# Altium schematic sheet Power_supply.SchDoc
size 420 x 297 mm; Address1: Address1; Address2: Address2; Address3: Address3; Address4: Address4; DocumentNumber: *Э3; SheetNumber: 4; SheetTotal: 10; DocumentType: Схема электрическая *
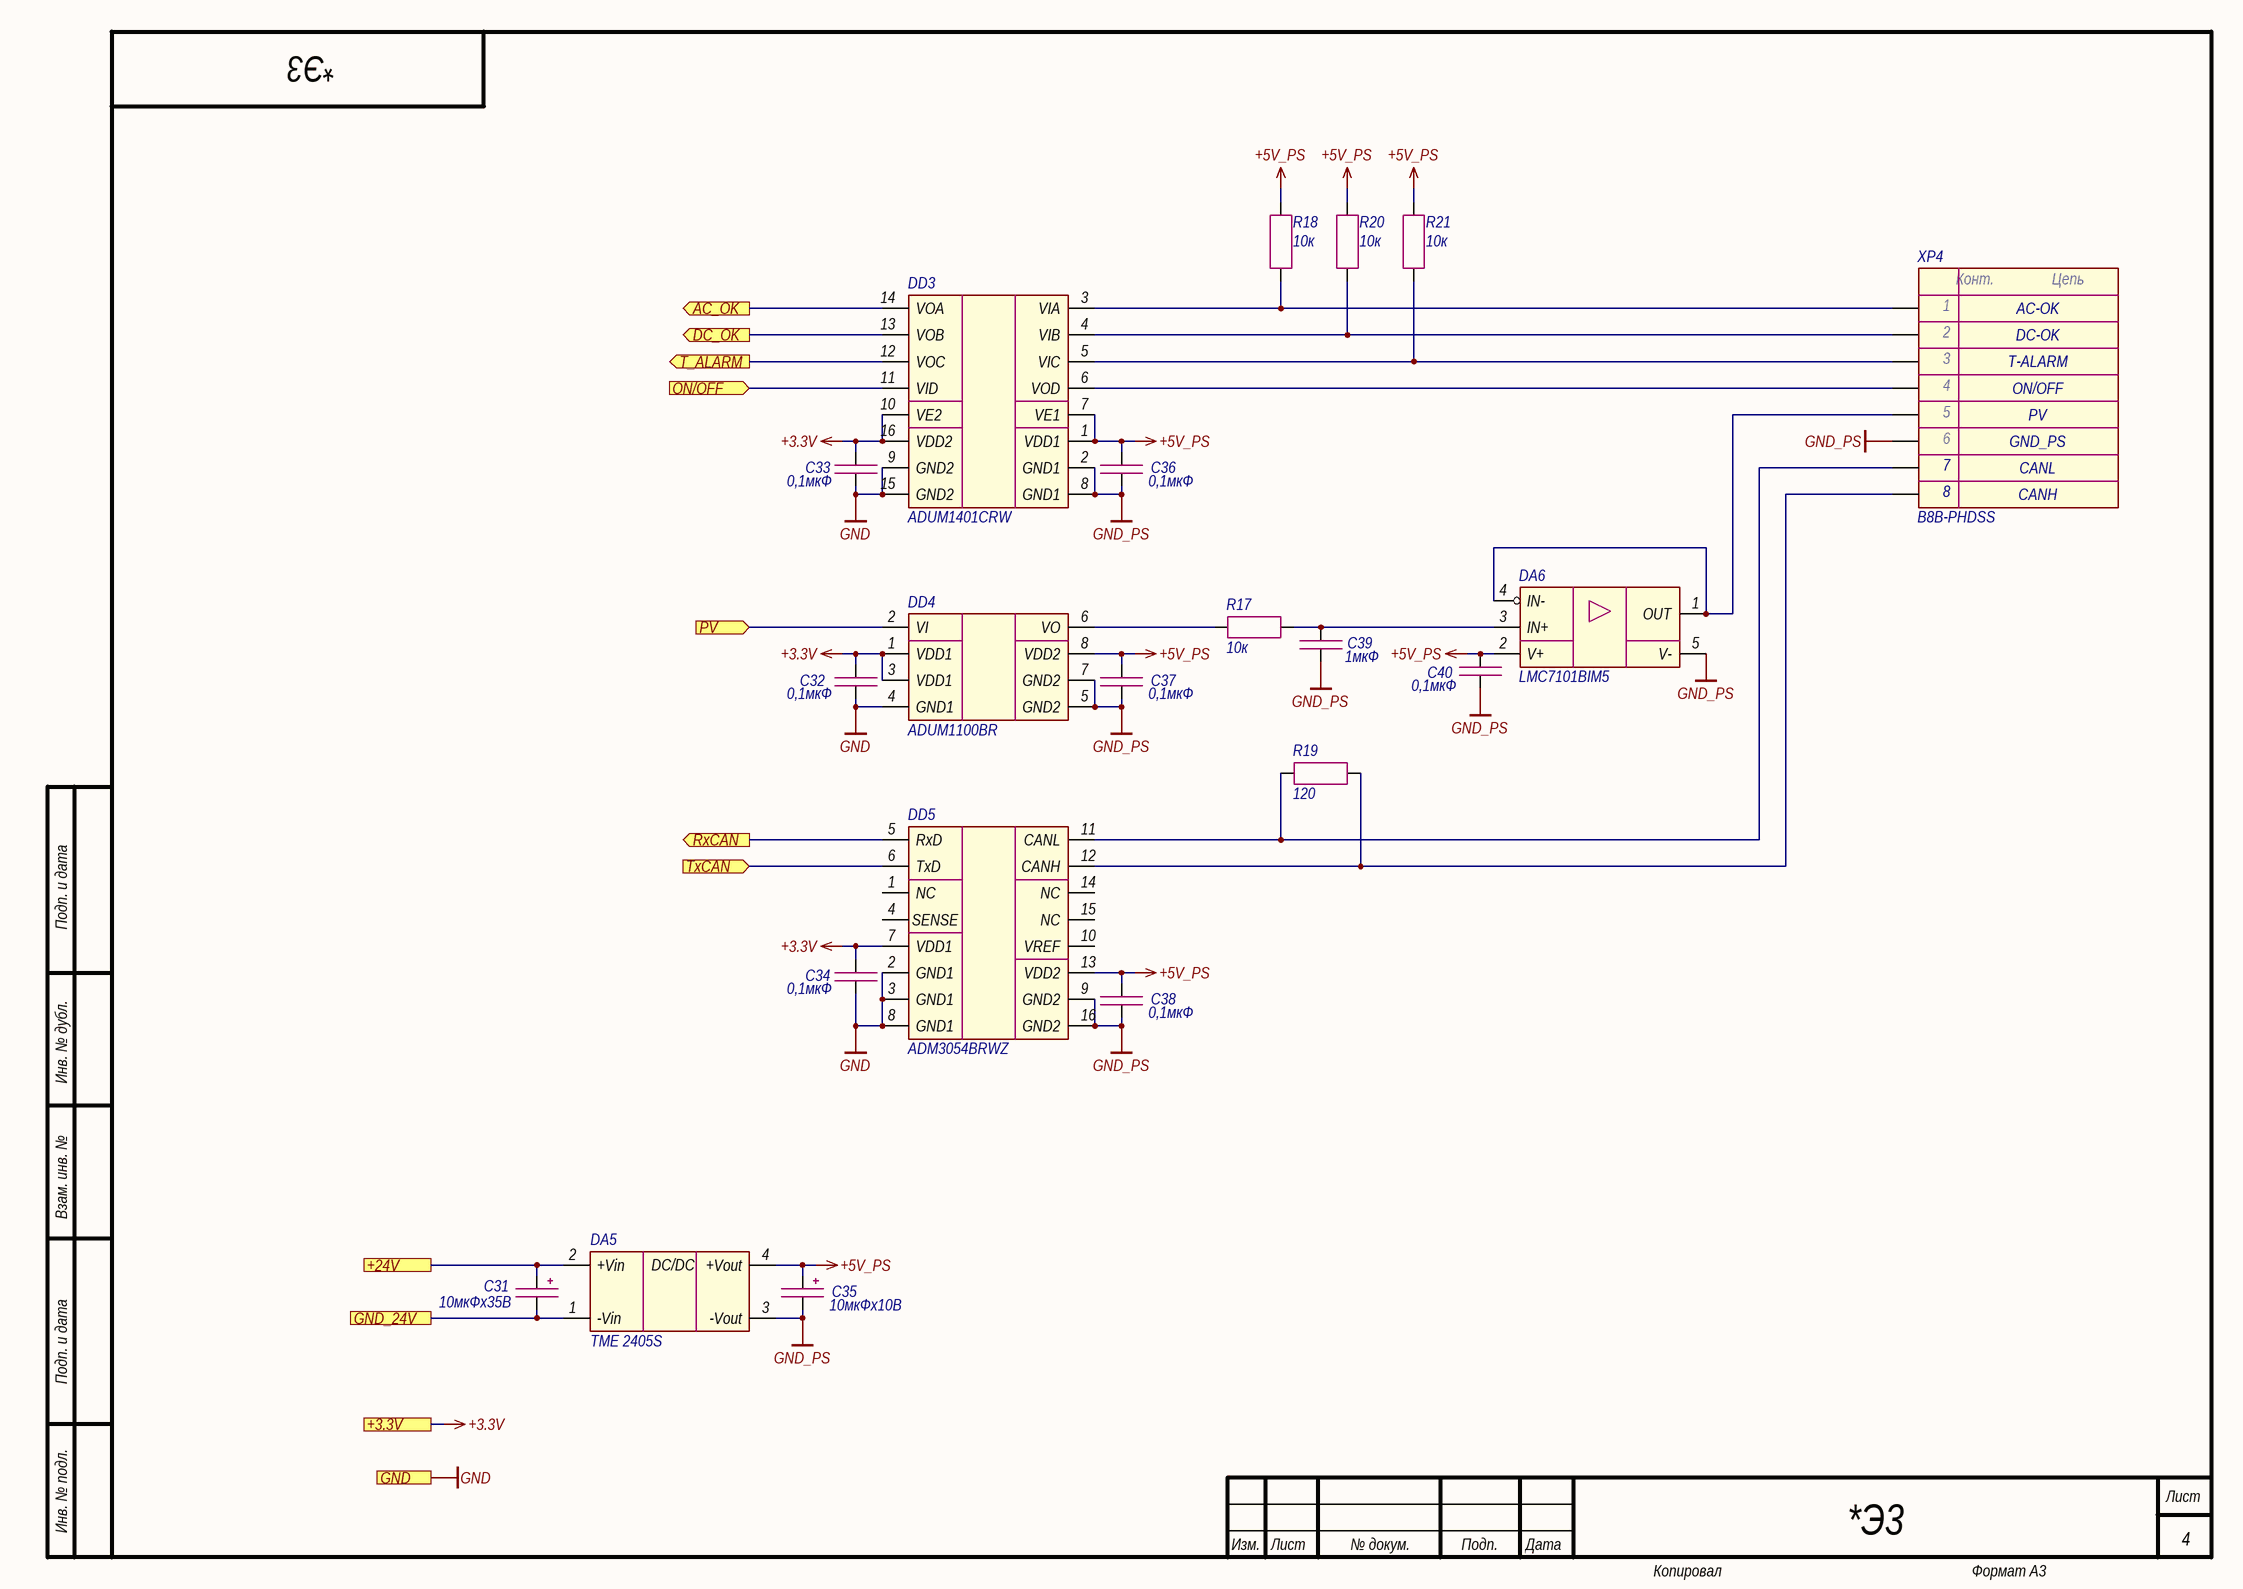
[diagram p0: Power_supply.SchDoc]

## Parts
C31  10мкФх35B  [CAP_C]
C32  0,1мкФ  [CAP_0603]
C33  0,1мкФ  [CAP_0603]
C34  0,1мкФ  [CAP_0603]
C35  10мкФх10B  [CAP_A]
C36  0,1мкФ  [CAP_0603]
C37  0,1мкФ  [CAP_0603]
C38  0,1мкФ  [CAP_0603]
C39  1мкФ  [CAP_0603]
C40  0,1мкФ  [CAP_0603]
DA5  TME 2405S  [TME (SIP-4)]
DA6  LMC7101BIM5  [SOT-23-5]
DD3  ADUM1401CRW  [SOIC-16W]
DD4  ADUM1100BR  [SOIC-8]
DD5  ADM3054BRWZ  [SOIC-16W]
R17  10к  [RES_0603]
R18  10к  [RES_0603]
R19  120  [RES_0805]
R20  10к  [RES_0603]
R21  10к  [RES_0603]
XP4  B8B-PHDSS  [B8B-PHDSS]

## Ports
+3.3V (see Main[1B], Ethernet[3D], Fiber_interlock[2C], Hardwiring[3D], LD_driver[1D]), +24V (see Main[1B], Hardwiring[3C], Indication[1C], LD_driver[1C]), AC_OK (out, see Main[2B]), DC_OK (out, see Main[2B]), GND (see Main[1B], Ethernet[3D], Fiber_interlock[2C], Guide_laser[1C], Hardwiring[3D], Indication[1C], LD_driver[1D]), GND_24V (see Main[1B], Hardwiring[3C], Indication[1C], LD_driver[1D]), ON/OFF (in, see Main[1B]), PV (in, see Main[1B]), RxCAN (out, see Main[2B]), T_ALARM (out, see Main[2B]), TxCAN (in, see Main[2B])

## Nets
+3.3V: C32.1 C33.1 C34.1 DD3.10(VE2) DD3.16(VDD2) DD4.1(VDD1) DD4.3(VDD1) DD5.7(VDD1) ; port +3.3V
+5V_PS: C35.1 C36.1 C37.1 C38.1 C40.1 DA5.4(+Vout) DA6.2(V+) DD3.1(VDD1) DD3.7(VE1) DD4.8(VDD2) DD5.13(VDD2) R18.1 R20.1 R21.1
GND: C32.2 C33.2 C34.2 DD3.9(GND2) DD3.15(GND2) DD4.4(GND1) DD5.2(GND1) DD5.3(GND1) DD5.8(GND1) ; port GND
GND_PS: C35.2 C36.2 C37.2 C38.2 C39.2 C40.2 DA5.3(-Vout) DA6.5(V-) DD3.2(GND1) DD3.8(GND1) DD4.5(GND2) DD4.7(GND2) DD5.9(GND2) DD5.16(GND2) XP4.6
+24V: C31.1 DA5.2(+Vin) ; port +24V
AC_OK: DD3.14(VOA) ; port AC_OK
DC_OK: DD3.13(VOB) ; port DC_OK
GND_24V: C31.2 DA5.1(-Vin) ; port GND_24V
ON/OFF: DD3.11(VID) ; port ON/OFF
PV: DD4.2(VI) ; port PV
RxCAN: DD5.5(RxD) ; port RxCAN
T_ALARM: DD3.12(VOC) ; port T_ALARM
TxCAN: DD5.6(TxD) ; port TxCAN
NetC39_1: C39.1 DA6.3(IN+) R17.2
NetDA6_1: DA6.1(OUT) DA6.4(IN-) XP4.5
NetDD3_3: DD3.3(VIA) R18.2 XP4.1
NetDD3_4: DD3.4(VIB) R20.2 XP4.2
NetDD3_5: DD3.5(VIC) R21.2 XP4.3
NetDD3_6: DD3.6(VOD) XP4.4
NetDD4_6: DD4.6(VO) R17.1
NetDD5_11: DD5.11(CANL) R19.1 XP4.7
NetDD5_12: DD5.12(CANH) R19.2 XP4.8

Not connected (* = marked no-connect by the designer): DD5 1(NC) 4(SENSE) 10(VREF) 14(NC) 15(NC)

## Notes on the sheet
- AC-OK
- DC-OK
- T-ALARM
- ON/OFF
- CANL
- GND_PS
- PV
- CANH
- Подп. и дата
- Инв. № дубл.
- Взам. инв. №
- Инв. № подл.
- Изм.
- Лист
- № докум.
- Подп.
- Дата
- Копировал
- Формат А3
- (in symbol Connector-8) Конт.; Цепь
- (in symbol TME) DC/DC

## Library data of the parts
C31 = Capacitor_Polar: Model: TECAP, 10 мкФ, 35 В, тип C, 10%; Value: 10мкФх35B; Document: *; Manufacturer: *
C32-C34 C36-C38 C40 = Capacitor: Manufacturer: Murata; Model: GRM188R71H104KA93D; Value: 0,1мкФ; Document: *
C35 = Capacitor_Polar: Model: TECAP, 10 мкФ, 10 В, тип A, 10%; Value: 10мкФх10B; Document: *; Manufacturer: *
C39 = Capacitor: Manufacturer: Murata; Model: GRM188R61H105KAALD; Value: 1мкФ; Document: *
DA5 = TME: Manufacturer: Traco Power; Model: TME 2405S; Document: *
DA6 = LMC7101: Manufacturer: Texas Instruments; Model: LMC7101BIM5; Document: *
DD3 = ADUM1401: Manufacturer: Analog Devices; Model: ADUM1401CRW; Document: *
DD4 = ADUM1100: Manufacturer: Analog Devices; Model: ADUM1100BR; Document: *
DD5 = ADM3054BRWZ: Manufacturer: Analog Devices; Model: ADM3054BRWZ; Document: *
R17 R18 R20 R21 = Resistor: Manufacturer: Yageo; Model: RC0603FR-0710KL; Value: 10к; Document: *
R19 = Resistor: Manufacturer: Yageo; Model: RC0805FR-07120RL; Value: 120; Document: *
XP4 = Connector-8: Manufacturer: JST; Model: B8B-PHDSS; Document: *